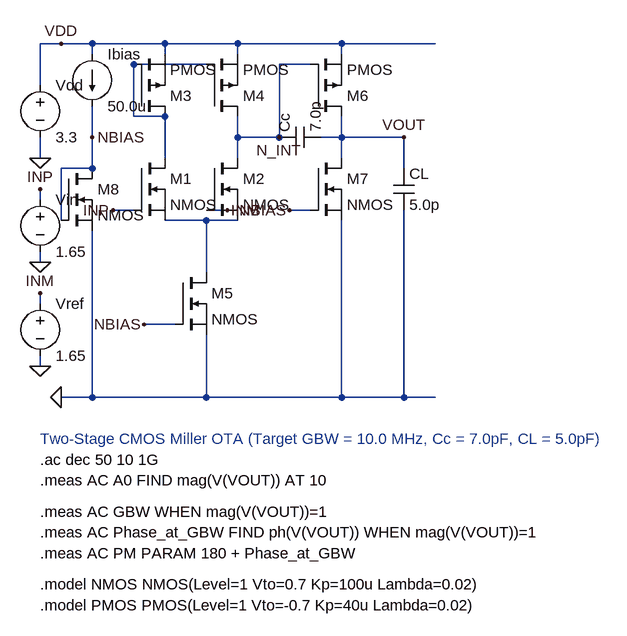
[diagram p0: schematic miller_ota.asc]
miller_ota.asc, the LTspice schematic file:
Version 4
SHEET 1 1400 1000
WIRE 112 96 688 96
WIRE 112 640 688 640
WIRE 80 96 80 160
WIRE 80 96 112 96
WIRE 80 240 80 272
WIRE 80 320 80 336
WIRE 80 416 80 432
WIRE 80 480 80 496
WIRE 80 576 80 592
WIRE 160 96 160 112
WIRE 160 192 160 240
WIRE 160 240 160 288
WIRE 160 288 112 288
WIRE 112 288 112 368
WIRE 160 384 160 640
WIRE 272 96 272 112
WIRE 272 208 224 208
WIRE 224 208 224 128
WIRE 384 96 384 112
WIRE 224 128 336 128
WIRE 272 208 272 272
WIRE 224 352 192 352
WIRE 384 208 384 272
WIRE 336 352 368 352
WIRE 272 368 336 368
WIRE 336 368 384 368
WIRE 336 368 336 448
WIRE 288 528 240 528
WIRE 336 544 336 640
WIRE 384 240 448 240
WIRE 448 240 448 128
WIRE 448 128 496 128
WIRE 544 96 544 112
WIRE 544 208 544 272
WIRE 496 352 464 352
WIRE 544 368 544 640
WIRE 512 240 544 240
WIRE 544 240 640 240
WIRE 640 240 640 288
WIRE 640 352 640 640
FLAG 112 96 VDD
FLAG 112 640 0
FLAG 80 272 0
FLAG 80 320 INP
FLAG 80 432 0
FLAG 80 480 INM
FLAG 80 592 0
FLAG 160 240 NBIAS
FLAG 192 352 INP
FLAG 368 352 INM
FLAG 240 528 NBIAS
FLAG 448 240 N_INT
FLAG 464 352 NBIAS
FLAG 640 240 VOUT
SYMBOL voltage 80 144 R0
SYMATTR InstName Vdd
SYMATTR Value 3.3
SYMBOL voltage 80 320 R0
SYMATTR InstName Vin
SYMATTR Value 1.65
SYMATTR Value2 AC 1
SYMBOL voltage 80 480 R0
SYMATTR InstName Vref
SYMATTR Value 1.65
SYMBOL current 160 112 R0
SYMATTR InstName Ibias
SYMATTR Value 50.0u
SYMBOL nmos 112 288 R0
SYMATTR InstName M8
SYMATTR Value NMOS
SYMATTR Value2 W=10u L=1u
SYMBOL pmos 224 208 M180
SYMATTR InstName M3
SYMATTR Value PMOS
SYMATTR Value2 W=25u L=1u
SYMBOL pmos 336 208 M180
SYMATTR InstName M4
SYMATTR Value PMOS
SYMATTR Value2 W=25u L=1u
SYMBOL nmos 224 272 R0
SYMATTR InstName M1
SYMATTR Value NMOS
SYMATTR Value2 W=20u L=1u
SYMBOL nmos 336 272 R0
SYMATTR InstName M2
SYMATTR Value NMOS
SYMATTR Value2 W=20u L=1u
SYMBOL nmos 288 448 R0
SYMATTR InstName M5
SYMATTR Value NMOS
SYMATTR Value2 W=20u L=1u
SYMBOL pmos 496 208 M180
SYMATTR InstName M6
SYMATTR Value PMOS
SYMATTR Value2 W=50u L=1u
SYMBOL nmos 496 272 R0
SYMATTR InstName M7
SYMATTR Value NMOS
SYMATTR Value2 W=20u L=1u
SYMBOL cap 448 256 R270
SYMATTR InstName Cc
SYMATTR Value 7.0p
SYMBOL cap 624 288 R0
SYMATTR InstName CL
SYMATTR Value 5.0p
TEXT 80 704 Left 2 ;Two-Stage CMOS Miller OTA (Target GBW = 10.0 MHz, Cc = 7.0pF, CL = 5.0pF)
TEXT 80 736 Left 2 !.ac dec 50 10 1G
TEXT 80 768 Left 2 !.meas AC A0 FIND mag(V(VOUT)) AT 10
TEXT 80 816 Left 2 !.meas AC GBW WHEN mag(V(VOUT))=1
TEXT 80 848 Left 2 !.meas AC Phase_at_GBW FIND ph(V(VOUT)) WHEN mag(V(VOUT))=1
TEXT 80 880 Left 2 !.meas AC PM PARAM 180 + Phase_at_GBW
TEXT 80 928 Left 2 !.model NMOS NMOS(Level=1 Vto=0.7 Kp=100u Lambda=0.02)
TEXT 80 960 Left 2 !.model PMOS PMOS(Level=1 Vto=-0.7 Kp=40u Lambda=0.02)

The netlist it stands for:
* miller_ota.asc
Vdd VDD 0 3.3
Vin INP 0 1.65 AC 1
Vref INM 0 1.65
Ibias VDD NBIAS 50.0u
M8 NBIAS NBIAS 0 0 NMOS W=10u L=1u
M3 N001 N001 VDD VDD PMOS W=25u L=1u
M4 N_INT N001 VDD VDD PMOS W=25u L=1u
M1 N001 INP N002 N002 NMOS W=20u L=1u
M2 N_INT INM N002 N002 NMOS W=20u L=1u
M5 N002 NBIAS 0 0 NMOS W=20u L=1u
M6 VOUT N_INT VDD VDD PMOS W=50u L=1u
M7 VOUT NBIAS 0 0 NMOS W=20u L=1u
Cc N_INT VOUT 7.0p
CL VOUT 0 5.0p
.model NMOS NMOS
.model PMOS PMOS
.lib standard.mos
* Two-Stage CMOS Miller OTA (Target GBW = 10.0 MHz, Cc = 7.0pF, CL = 5.0pF)
.ac dec 50 10 1G
.meas AC A0 FIND mag(V(VOUT)) AT 10
.meas AC GBW WHEN mag(V(VOUT))=1
.meas AC Phase_at_GBW FIND ph(V(VOUT)) WHEN mag(V(VOUT))=1
.meas AC PM PARAM 180 + Phase_at_GBW
.model NMOS NMOS(Level=1 Vto=0.7 Kp=100u Lambda=0.02)
.model PMOS PMOS(Level=1 Vto=-0.7 Kp=40u Lambda=0.02)
.backanno
.end